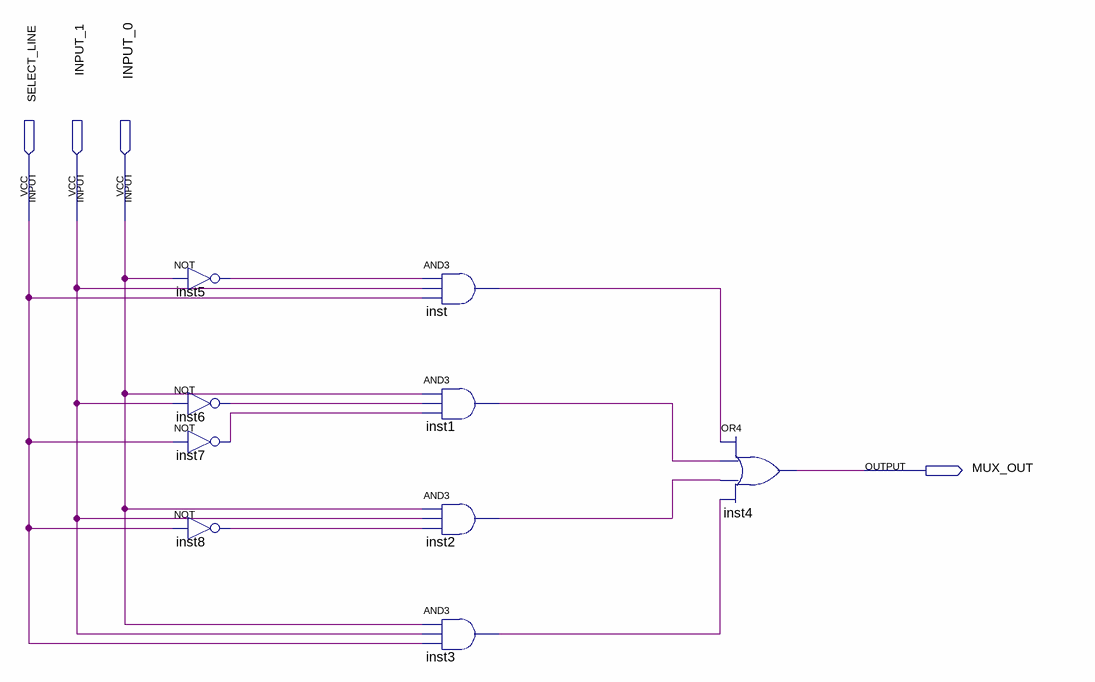
[diagram p0: schematic sheet]
// Quartus schematic MUX_GATES.bdf as structural Verilog: 9 symbols, 4 pins
module MUX_GATES (
  input  SELECT_LINE,
  input  INPUT_1,
  input  INPUT_0,
  output MUX_OUT
);

  wire inst1_out, inst2_out, inst3_out, inst5_out, inst6_out, inst7_out, inst8_out, inst_out;

  not inst5 (inst5_out, INPUT_0);
  not inst6 (inst6_out, INPUT_1);
  not inst7 (inst7_out, SELECT_LINE);
  not inst8 (inst8_out, SELECT_LINE);
  and inst (inst_out, inst5_out, INPUT_1, SELECT_LINE);
  and inst1 (inst1_out, INPUT_0, inst6_out, inst7_out);
  and inst2 (inst2_out, INPUT_0, INPUT_1, inst8_out);
  and inst3 (inst3_out, INPUT_0, INPUT_1, SELECT_LINE);
  or inst4 (MUX_OUT, inst_out, inst1_out, inst2_out, inst3_out);
endmodule
